# EAGLE design UKHASnetWifiNode (EAGLE 6.3)
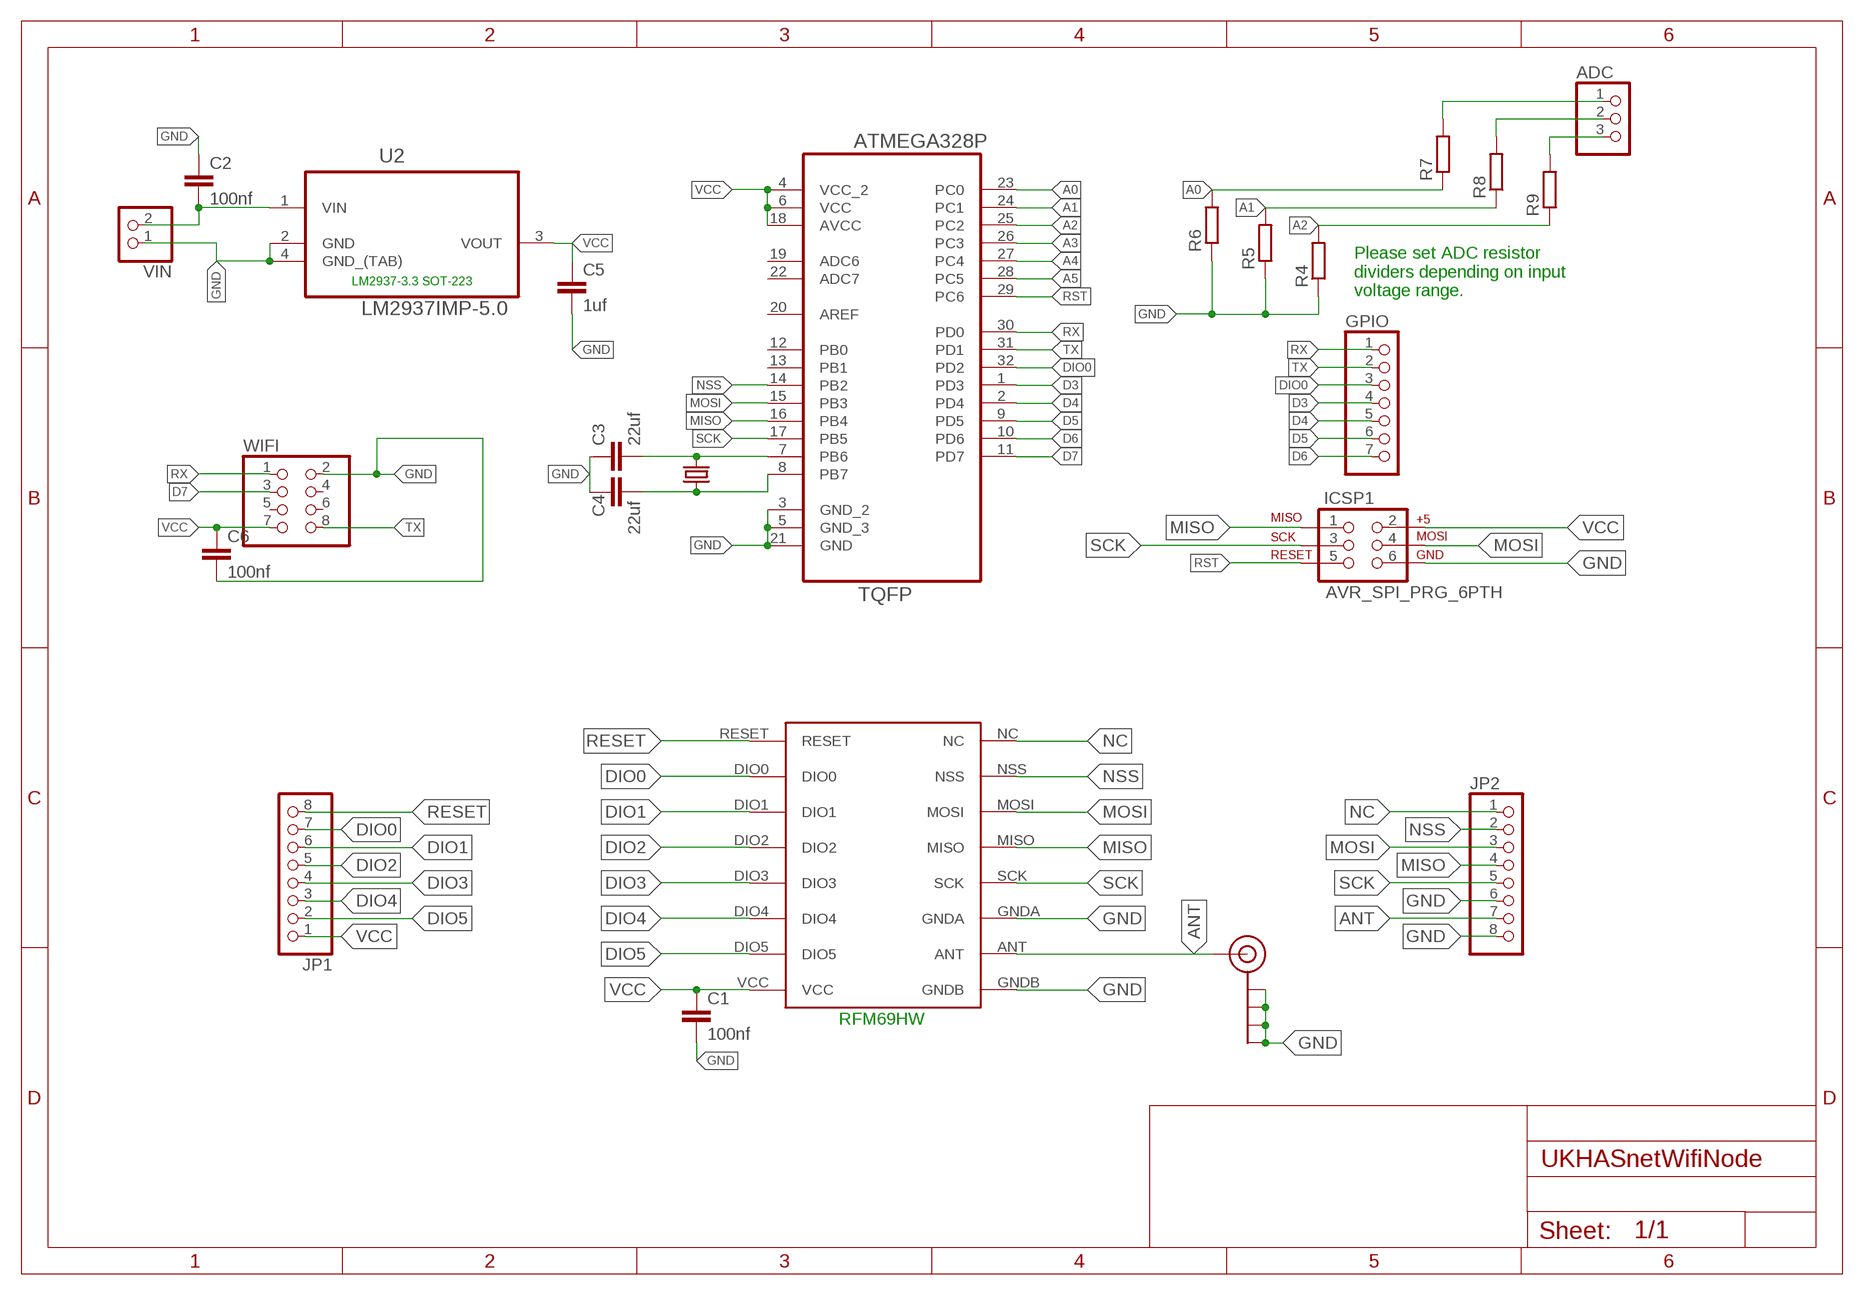
[diagram p0: schematic, sheet 1]

## Parts
ADC  PINHD-1X3  [1X03]
C1  100nf  C-EUC0603  [C0603]
C2  100nf  C-EUC0603  [C0603]
C3  22uf  C-EUC0603  [C0603]
C4  22uf  C-EUC0603  [C0603]
C5  1uf  C-EUC0603  [C0603]
C6  100nf  C-EUC0603  [C0603]
GPIO  PINHD-1X7  [1X07]
ICSP1  AVR_SPI_PRG_6PTH  [2X3]
J$1  SMA_EDGE  [SMA-EDGE]
JP1  PINHD-1X8  [1X08]
JP2  PINHD-1X8  [1X08]
R4  R-EU_R0603  [R0603]
R5  R-EU_R0603  [R0603]
R6  R-EU_R0603  [R0603]
R7  R-EU_R0603  [R0603]
R8  R-EU_R0603  [R0603]
R9  R-EU_R0603  [R0603]
U1  ATMEGA328P-AU  [QFP80P900X900X120-32N]
U2  LM2937IMP-5.0  [SOT230P700X180-4N]
U$1  RFM69HW  [RFM]
U$2  8MHz  ABRACON_ABM3_CRYSTALABM03_HC49  [ABM03_HC49]
VIN  PINHD-1X2  [1X02]
WIFI  PINHD-2X4  [2X04]

## Nets
A0: R6.2 R7.1 U1.23(PC0)
A1: R5.2 R8.1 U1.24(PC1)
A2: R4.2 R9.1 U1.25(PC2)
A3: U1.26(PC3)
A4: U1.27(PC4)
A5: U1.28(PC5)
ANT: J$1.SIG(SIGNAL) JP2.7 U$1.ANT
D3: GPIO.4 U1.1(PD3)
D4: GPIO.5 U1.2(PD4)
D5: GPIO.6 U1.9(PD5)
D6: GPIO.7 U1.10(PD6)
D7: U1.11(PD7) WIFI.3(CH_PD)
DIO0: GPIO.3 JP1.7 U1.32(PD2) U$1.DIO0
DIO1: JP1.6 U$1.DIO1
DIO2: JP1.5 U$1.DIO2
DIO3: JP1.4 U$1.DIO3
DIO4: JP1.3 U$1.DIO4
DIO5: JP1.2 U$1.DIO5
GND: C1.2 C2.1 C3.1 C4.1 C5.2 C6.2 ICSP1.6 J$1.GND@0(GND) J$1.GND@1(GND) J$1.GND@2(GND) J$1.GND@3(GND) JP2.6 JP2.8 R4.1 R5.1 R6.1 U1.3(GND_2) U1.5(GND_3) U1.21(GND) U2.2(GND) U2.4(GND_(TAB)) U$1.GNDA U$1.GNDB VIN.1 WIFI.2(GND)
MISO: ICSP1.1 JP2.4 U1.16(PB4) U$1.MISO
MOSI: ICSP1.4 JP2.3 U1.15(PB3) U$1.MOSI
N$2: C3.2 U1.7(PB6) U$2.2
N$3: C4.2 U1.8(PB7) U$2.1
N$7: C2.2 U2.1(VIN) VIN.2
N$8: ADC.1 R7.2
N$9: ADC.2 R8.2
N$10: ADC.3 R9.2
NC: JP2.1 U$1.NC
NSS: JP2.2 U1.14(PB2) U$1.NSS
RESET: JP1.8 U$1.RESET
RST: ICSP1.5 U1.29(PC6)
RX: GPIO.1 U1.30(PD0) WIFI.1(TXD)
SCK: ICSP1.3 JP2.5 U1.17(PB5) U$1.SCK
TX: GPIO.2 U1.31(PD1) WIFI.8(RXD)
VCC: C1.1 C5.1 C6.1 ICSP1.2 JP1.1 U1.4(VCC_2) U1.6(VCC) U1.18(AVCC) U2.3(VOUT) U$1.VCC WIFI.7(VCC)
Unconnected: U1.12(PB0) U1.13(PB1) U1.19(ADC6) U1.20(AREF) U1.22(ADC7) WIFI.4(GPIO2) WIFI.5(GPIO16) WIFI.6(GPIO0)

## Notes on the sheet
- LM2937-3.3 SOT-223
- Please set ADC resistor
  dividers depending on input
  voltage range.
- RFM69HW

## Library data of the parts
ADC = pinhead:PINHD-1X3: PIN HEADER
C1-C6 = rcl:C-EU: CAPACITOR, European symbol
GPIO = pinhead:PINHD-1X7: PIN HEADER
ICSP1 = SparkFun-Connectors:AVR_SPI_PRG_6: AVR ISP 6 Pin This is the reduced ISP connector for AVR programming. Common on Arduino. This footprint will take up less PCB space and can be used with a 10-pin to 6-pin adapter such as SKU: BOB-08508
J$1 = SparkFun-Connectors:SMA_EDGE: SMA Antenna Connector End launch SMA connector. The paste layer has been removed so that the connector can be hand soldered onto the board after reflow.
JP1 JP2 = pinhead:PINHD-1X8: PIN HEADER
R4-R9 = rcl:R-EU_: RESISTOR, European symbol
U1 = Ava:ATMEGA328P-AU; DESCRIPTION: 8-bit Microcontroller with In-System Programmable Flash; MPN: ATMEGA328P-AU; OC_FARNELL: 1715486; OC_NEWARK: 14R4631; PACKAGE: TQFP-32; SUPPLIER: Atmel
U2 = Ava:LM2937IMP-5.0: IC, LDO VOLT REG, 5V, 0.5A; MPN: LM2937IMP-5.0; OC_FARNELL: 1798318; OC_NEWARK: 83F3856; PACKAGE: SOT-223-3; SUPPLIER: Microchip
U$1 = hopeRF2:RFM69HW
U$2 = Ava:ABRACON_ABM3_CRYSTAL
VIN = pinhead:PINHD-1X2: PIN HEADER
WIFI = ChrisStubbs:PINHD-2X4: PIN HEADER

## Board
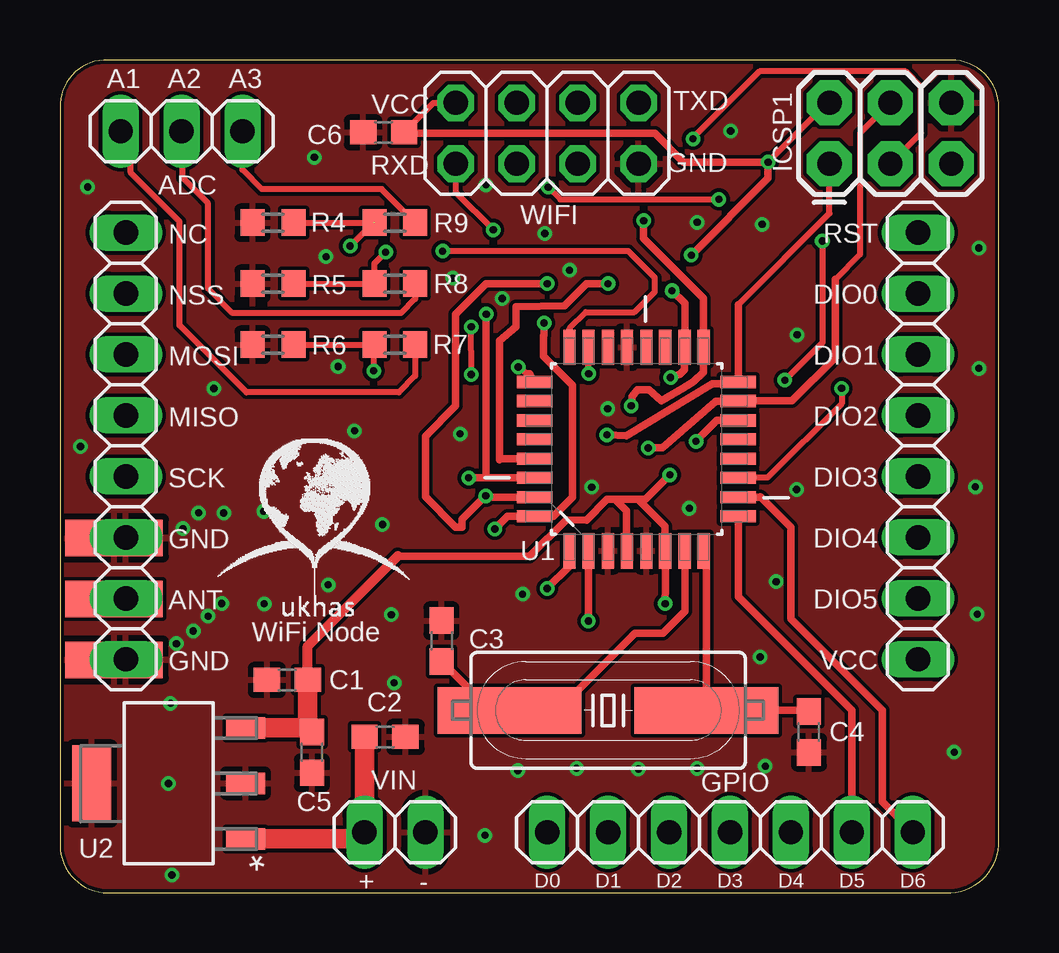
[diagram p1: board, top side]
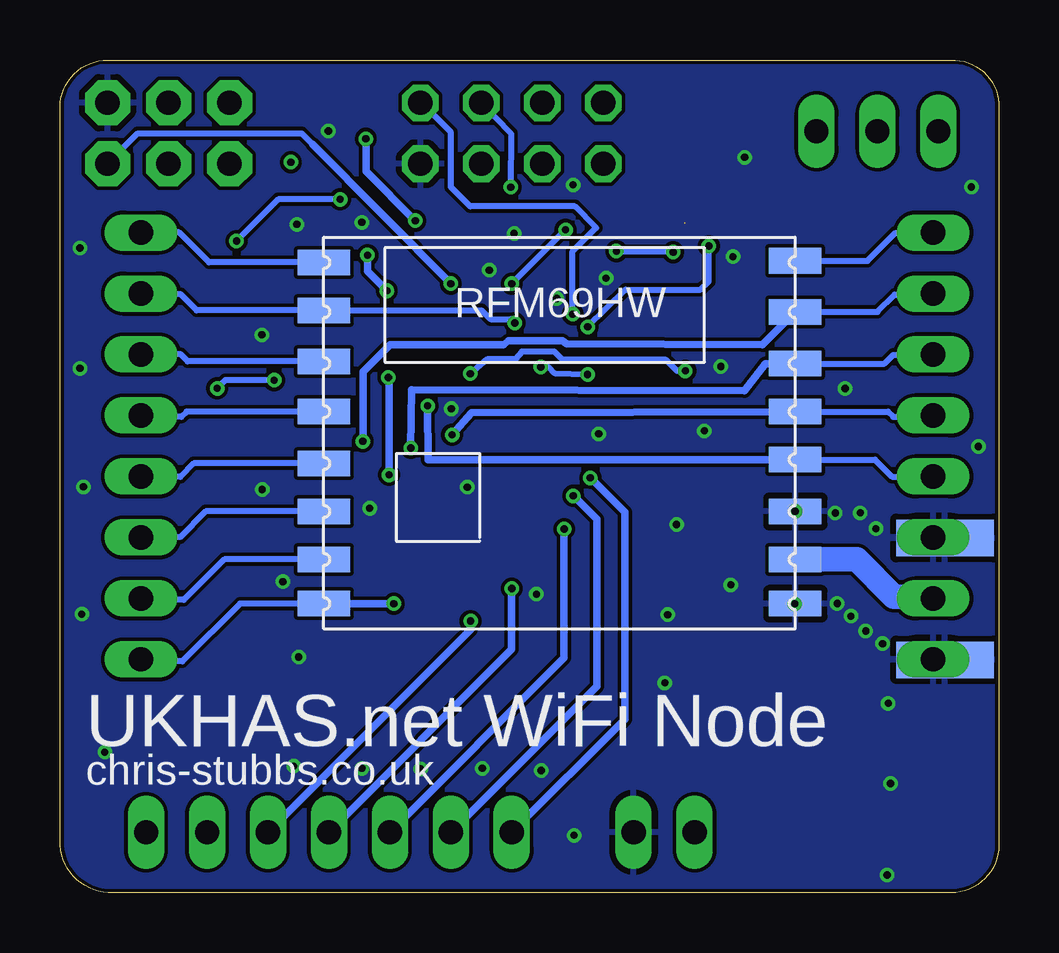
[diagram p2: board, bottom side, seen from below]

Size 39.14 x 34.7 mm. Coordinates in mm from the lower left corner, seen from the top.
Outline: 0,32.71 0,1.99 arc90 2,0 37.14,0 arc82 39.14,1.98 39.14,32.72 arc90 37.14,34.7 2,34.7 arc93 0,32.71
Copper layers (1*16): Top 0.035mm / dielectric 1.5mm / Bottom 0.035mm
Design rules "Hackvana": minimum track width 6mil, minimum drill 0.3mm, track to track 6mil, track to pad 6mil, pad to pad 6mil, via to via 6mil, smd to smd 0mil, copper to edge 6mil, drill to drill 6mil, minimum pad ring 10mil, minimum via ring 6mil, stop-mask expansion 2mil, vias tented up to drill 100mil, thermal gap 10mil

### Footprints (pad centres in the part's own frame; a part is rotated, then mirrored left to right if it is on the bottom)
1X03 = drill 1.016 long: 1 -2.54,0; 2 0,0; 3 2.54,0
C0603 = smd 1.1 x 1: 1 -0.85,0; 2 0.85,0
1X07 = drill 1.016 long: 1 -7.62,0; 2 -5.08,0; 3 -2.54,0; 4 0,0; 5 2.54,0; 6 5.08,0; 7 7.62,0
2X3 = drill 1.016 pad 1.88 octagon: 1 0,0; 2 0,2.54; 3 2.54,0; 4 2.54,2.54; 5 5.08,0; 6 5.08,2.54
SMA-EDGE = smd 1.524 x 4.064: GND@0 0,0; GND@1 5.08,0; SIG 2.54,0 | smd 1.524 x 4.064 bottom: GND@2 0,0; GND@3 5.08,0
1X08 = drill 1.016 long: 1 -8.89,0; 2 -6.35,0; 3 -3.81,0; 4 -1.27,0; 5 1.27,0; 6 3.81,0; 7 6.35,0; 8 8.89,0
R0603 = smd 1 x 1.1: 1 -0.85,0; 2 0.85,0
QFP80P900X900X120-32N = smd 1.473 x 0.508: 1 -4.242,2.794; 2 -4.242,2.007; 3 -4.242,1.194; 4 -4.242,0.406; 5 -4.242,-0.406; 6 -4.242,-1.194; 7 -4.242,-2.007; 8 -4.242,-2.794; 17 4.242,-2.794; 18 4.242,-2.007; 19 4.242,-1.194; 20 4.242,-0.406; 21 4.242,0.406; 22 4.242,1.194; 23 4.242,2.007; 24 4.242,2.794 | smd 0.508 x 1.473: 9 -2.794,-4.242; 10 -2.007,-4.242; 11 -1.194,-4.242; 12 -0.406,-4.242; 13 0.406,-4.242; 14 1.194,-4.242; 15 2.007,-4.242; 16 2.794,-4.242; 25 2.794,4.242; 26 2.007,4.242; 27 1.194,4.242; 28 0.406,4.242; 29 -0.406,4.242; 30 -1.194,4.242; 31 -2.007,4.242; 32 -2.794,4.242
SOT230P700X180-4N = smd 1.626 x 0.889: 1 -3.2,2.311; 2 -3.2,0; 3 -3.2,-2.311 | smd 1.626 x 3.175: 4 3.2,0
RFM = smd 2.184 x 1.067: ANT 19.651,2.889; DIO0 0,13.27; DIO1 0,11.143; DIO2 0,9.047; DIO3 0,6.889; DIO4 0,4.889; DIO5 0,2.889; GNDA 19.651,4.889; GNDB 19.651,1.048; MISO 19.651,9.047; MOSI 19.651,11.047; NC 19.651,15.334; NSS 19.651,13.206; RESET 0,15.27; SCK 19.651,7.048; VCC 0,1.048
ABM03_HC49 = smd 6 x 1.93: 1 -4.1,0; 2 4.1,0
1X02 = drill 1.016 long: 1 -1.27,0; 2 1.27,0
2X04 = drill 1.016 octagon: 1 -3.81,-1.27; 2 -3.81,1.27; 3 -1.27,-1.27; 4 -1.27,1.27; 5 1.27,-1.27; 6 1.27,1.27; 7 3.81,-1.27; 8 3.81,1.27

### Placement (x,y rotation side)
ADC  5.07,31.73 0 top
C1  9.48,8.87 180 top
C2  13.55,6.5 180 top
C3  15.9,10.49 270 top
C4  31.22,6.7 90 top
C5  10.5,5.85 270 top
C6  13.49,31.69 180 top
GPIO  27.93,2.52 0 top
ICSP1  32.08,30.38 0 top
J$1  2.26,9.7 90 top
JP1  35.76,18.62 90 top
JP2  2.74,18.62 270 top
R4  8.88,27.92 0 top
R5  8.88,25.38 0 top
R6  8.88,22.84 0 top
R7  13.96,22.84 0 top
R8  13.96,25.38 0 top
R9  13.96,27.92 0 top
U1  24.04,18.49 90 top
U2  4.53,4.56 180 top
U$1  28.14,11 0 bottom
U$2  22.85,7.6 180 top
VIN  13.96,2.52 180 top
WIFI  20.31,31.64 180 top

### Tracks (layer width: path | path; a pad name or v marks a point on that pad's centre or on a via)
A0  (via drill 0.3)
  Top 0.254: v22.04,21.63 U1.23 | R6.2 13.08,22.84 | 13.08,22.84 R7.1 13.07,22.8 v13.07,21.74 | 13.08,22.84 13.07,22.83
  Bottom 0.254: v13.07,21.74 13.41,21.74 13.87,22.2 18.19,22.2 18.53,22.54 19.89,22.54 20.16,22.23 21.33,22.23 v22.04,21.63
A1  (via drill 0.3)
  Top 0.254: U1.24 21.24,23.52 21.92,24.19 23.95,24.19 24.8,25.04 24.8,25.63 23.7,26.73 v15.95,26.73 | v13.58,26.69 13.11,26.22 R8.1 R5.2
  Bottom 0.254: v15.95,26.73 13.62,26.73 v13.58,26.69
A2  (via drill 0.3)  (1 unrouted)
  Top 0.254: U1.25 19.63,21.61 19.59,21.65 19.42,21.65 v19.1,21.91 | v17.15,21.6 v17.15,23.58 | v12.1,26.95 13.07,27.92 | R4.2 R9.1
  Bottom 0.254: v19.1,21.91 18.78,21.91 18.53,21.65 v17.15,21.6 | v17.15,23.58 15.57,25.13 12.43,25.13 12.1,25.46 v12.1,26.95
ANT
  Top 0.305: JP2.7 2.28,12.27 J$1.SIG
  Bottom 0.254: 2.81,12.34 JP2.7
  Bottom 1.016: U$1.ANT 5.93,13.89 4.39,12.34 2.81,12.34
D3  (via drill 0.3)
  Top 0.305: v20.31,12.68 21.24,13.61 U1.1
  Bottom 0.305: GPIO.4 20.31,10.14 v20.31,12.68
D4  (via drill 0.3)
  Top 0.305: v22.03,11.32 U1.2
  Bottom 0.305: GPIO.5 22.03,10.96 v22.03,11.32
D5
  Top 0.305: GPIO.6 33.01,7.6 28.28,12.33 U1.9
D6
  Top 0.305: GPIO.7 34.28,3.79 34.28,7.6 30.47,11.41 30.47,15.22 29.2,16.49 29.19,16.48 U1.10
D7  (via drill 0.3)
  Top 0.254: v20.35,29.4 20.86,28.89 v27.46,28.89 | v31.78,27.16 31.78,22.92 v30.21,21.36 | v32.59,21.02 32.59,20.38 29.49,17.29 U1.11
  Bottom 0.254: WIFI.3 20.35,31.64 v20.35,29.4 | v27.46,28.89 30.05,28.89 v31.78,27.16 | v30.21,21.36 32.25,21.36 v32.59,21.02
DIO0  (via drill 0.3)
  Top 0.254: 20.18,23.24 20.16,23.22
  Top 0.305: v18.12,15.16 18.66,15.69 U1.32 20.57,15.69 21.36,16.48 21.36,21.15 20.16,22.35 20.16,23.22 | v20.18,23.74 20.18,23.24
  Bottom 0.254: JP1.7 35.74,24.94 34.12,24.94 33.45,24.27 U$1.DIO0 21.57,24.27 21.2,23.9 20.34,23.9 v20.18,23.74
  Bottom 0.305: GPIO.3 18.12,9.78 v18.12,15.16
DIO1
  Bottom 0.254: U$1.DIO1 33.82,22.14 34.12,22.44 35.75,22.44 JP1.6
DIO2
  Bottom 0.254: U$1.DIO2 33.87,20.05 34.08,19.83 35.71,19.83 JP1.5
DIO3
  Bottom 0.254: U$1.DIO3 33.56,17.89 34.12,17.33 35.75,17.33 JP1.4
DIO4
  Bottom 0.254: U$1.DIO4 33.07,15.89 34.14,14.81 35.14,14.81 35.55,15.22 35.55,15.02 JP1.3
DIO5
  Bottom 0.254: U$1.DIO5 32.29,13.89 33.98,12.2 35.7,12.2 JP1.2
GND  (via drill 0.3)
  other vias: 38.16,16.91 26.24,16.02 22.83,20.17 22.16,16.9 37.28,5.86 38.31,21.85 38.23,11.61 38.31,26.86 17.71,2.39 19.08,5.1 21.54,5.19 24.11,5.16 26.56,5.19 29.4,5.27 4.67,0.74 4.52,4.55 4.61,7.89 8.51,12.04 11.18,12.83 13.81,11.59 13.93,8.75 19.28,12.44 13.44,15.34 12.28,19.25 6.42,21.01 11.59,21.93 11.09,26.5 16.38,25.6 21.24,25.94 10.6,30.64 1.15,29.41 0.86,18.59 8.5,15.9 6.74,12.05 6.17,11.53 5.56,10.91 4.85,10.38 6.82,15.82 5.78,15.83 5.13,15.17 30.73,23.25 16.68,19.12 29.85,12.96 27.96,31.74 17.76,29.5 20.21,27.47 26.56,27.93 29.27,27.85 30.71,16.8 18.43,24.76 29.19,9.83
  pour Bottom: 0.2,34.49 38.94,34.49 38.94,0.2 0.2,0.2
  pour Top: 0.2,34.49 38.94,34.49 38.94,0.2 0.2,0.2
MISO  (via drill 0.3)
  Top 0.254: 28.28,24.51 32.08,28.31 ICSP1.1
  Top 0.305: 28.27,21.27 U1.16 | U1.16 28.28,24.51 | v22.8,19.08 23.62,19.04 27.19,21.22 28.21,21.22 U1.16
  Bottom 0.254: U$1.MISO 4.63,20.05 4.41,19.83 2.8,19.83 JP2.4
  Bottom 0.305: U$1.MISO 21.99,20 v22.8,19.08
MOSI  (via drill 0.3)
  Top 0.254: ICSP1.4 33.35,31.65 33.35,26.6 32.31,25.56
  Top 0.305: 32.31,25.56 32.31,22.29 30.51,20.49 U1.15 28.27,20.48 27.35,20.48 25.11,18.54 v24.52,18.53
  Bottom 0.254: U$1.MOSI 4.78,22.05 4.41,22.41 2.76,22.41 JP2.3
  Bottom 0.305: U$1.MOSI 9.73,22.05 10.61,20.91 24.49,20.95 v24.52,18.53
N$2
  Top 0.305: U1.7 26.05,11.73 25.13,10.81 23.97,10.81 20.75,7.6 U$2.2 17.94,7.6 C3.2
N$3
  Top 0.305: U1.8 26.95,14.12 U$2.1 31.17,7.6 C4.2
N$7
  Top 0.813: U2.1 12.41,2.24 VIN.2 12.69,5.29 C2.2
N$8
  Top 0.254: R7.2 14.81,21.53 14.13,20.85 7.78,20.85 4.98,23.64 4.98,27.96 2.95,29.99 2.95,31.31 ADC.1
N$9
  Top 0.254: R8.2 14.81,24.75 14.21,24.15 7.19,24.15 6.17,25.17 6.17,28.72 5.11,29.78 5.11,31.69 ADC.2
N$10
  Top 0.254: R9.2 13.41,29.32 8.41,29.32 7.61,30.12 ADC.3
NC
  Bottom 0.254: U$1.NC 5.48,26.33 4.31,27.5 2.75,27.5 JP2.1
NSS  (via drill 0.3)
  Top 0.305: v26.51,18.81 27.39,19.68 U1.14
  Bottom 0.254: U$1.NSS 5.06,24.2 4.35,24.92 2.79,24.92 JP2.2
  Bottom 0.305: U$1.NSS 9.86,22.84 18.02,22.88 18.19,23.01 20.44,23.01 20.65,22.84 25.39,22.84 26.51,21.71 v26.51,18.81
RESET
  Bottom 0.254: U$1.RESET 32.93,26.27 34.18,27.51 JP1.8
RST  (via drill 0.3)
  Top 0.305: v22.85,25.38 21.95,25.38 21.02,24.46 19,24.41 19,23.57 18.33,22.99 18.32,21.94 18.33,18.04 18.36,18.09 U1.29
  Bottom 0.254: ICSP1.5 35.89,31.64 29.06,31.64 28.61,31.18
  Bottom 0.305: 28.61,31.18 v22.85,25.38
RX  (via drill 0.3)
  Top 0.305: v17.03,17.29 v17.04,17.29 17.77,17.29 | 17.77,17.29 U1.30 | v17.77,24.11 17.77,17.29
  Bottom 0.254: v17.77,24.11 17.77,26.73 16.8,27.71 17.68,28.6 22.04,28.6 22.85,29.4 22.85,31.69 24.08,32.91 WIFI.1
  Bottom 0.305: GPIO.1 15.6,7.23 15.6,15.85 v17.03,17.29
SCK  (via drill 0.3)
  Top 0.254: ICSP1.3 35.89,31.65 35.89,33.59 35.25,34.23 29.16,34.23 26.39,31.46 v26.39,31.42
  Top 0.305: v23.82,20.29 23.84,20.67 24.08,20.96 24.55,20.97 25.07,20.49 25.97,21.02 26.4,21.29 26.81,21.69 26.81,22.71 U1.17 26.83,24.77 24.33,27.27 v24.33,28
  Bottom 0.254: U$1.SCK 5.17,18.05 4.46,17.34 JP2.5
  Bottom 0.305: U$1.SCK 23.79,18.04 v23.82,20.29 | v26.39,31.42 26.39,30.06 v24.33,28
TX  (via drill 0.3)
  Top 0.254: WIFI.8 16.5,29.19 v18.07,27.62
  Top 0.305: U1.31 17.79,16.48 v17.75,16.54 17.16,15.95 17.09,15.89 16.76,15.56 16.76,15.22 16.5,15.22 15.23,16.49 15.23,19.03 16.5,20.3 16.5,24.11 17.77,25.38 v20.31,25.38
  Bottom 0.254: v18.07,27.62 | v18.07,27.62 v20.31,25.38
  Bottom 0.305: GPIO.2 16.76,8.61 16.76,15.56 17.68,16.48 v17.75,16.54
VCC  (via drill 0.3)
  Top 0.254: v29.52,30.44 31.99,32.92 ICSP1.2 | WIFI.7 15.57,32.91 C6.1 14.39,31.64
  Top 0.305: 14.08,14.03 19.57,14.03 21.11,15.53 21.94,15.52 22.79,16.4 23.14,16.4 | 23.14,16.4 23.61,15.92 23.61,14.26 U1.4 | 23.14,16.4 24.1,16.4 | 24.1,16.4 25.23,15.27 U1.6 25.23,12.79 v25.22,12.05 | 14.39,31.64 24.8,31.64 26,30.44 v29.52,30.44 29.52,29.76 v26.32,26.56 | 24.1,16.4 24.41,16.4 v25.42,17.41 | v25.45,21.47 25.85,21.61 26.03,21.79 26.03,22.72 U1.18 26.04,24.56 v25.52,25.08
  Top 0.406: C1.1 10.33,10.27 14.08,14.03
  Top 0.813: U2.3 10.33,6.87 | 10.33,6.87 C5.1 | 10.33,6.87 C1.1
  Bottom 0.254: U$1.VCC 31.64,12.05 34.05,9.64 35.68,9.64 JP1.1
  Bottom 0.305: v25.22,12.05 U$1.VCC | U$1.VCC | v25.42,17.41 25.42,21.59 v25.45,21.47 | v25.52,25.08 26.32,25.89 v26.32,26.56

### Text on the board
tPlace: A1 | A2 | A3 | TXD | VCC | RXD | GND | NC | RST | NSS | DIO0 | MOSI | DIO1 | MISO | DIO2 | SCK | DIO3 | GND | DIO4 | ANT | DIO5 | WiFi Node | GND | VCC | + | - | D0 | D1 | D2 | D3 | D4 | D5 | D6
bPlace: UKHAS.net WiFi Node | chris-stubbs.co.uk